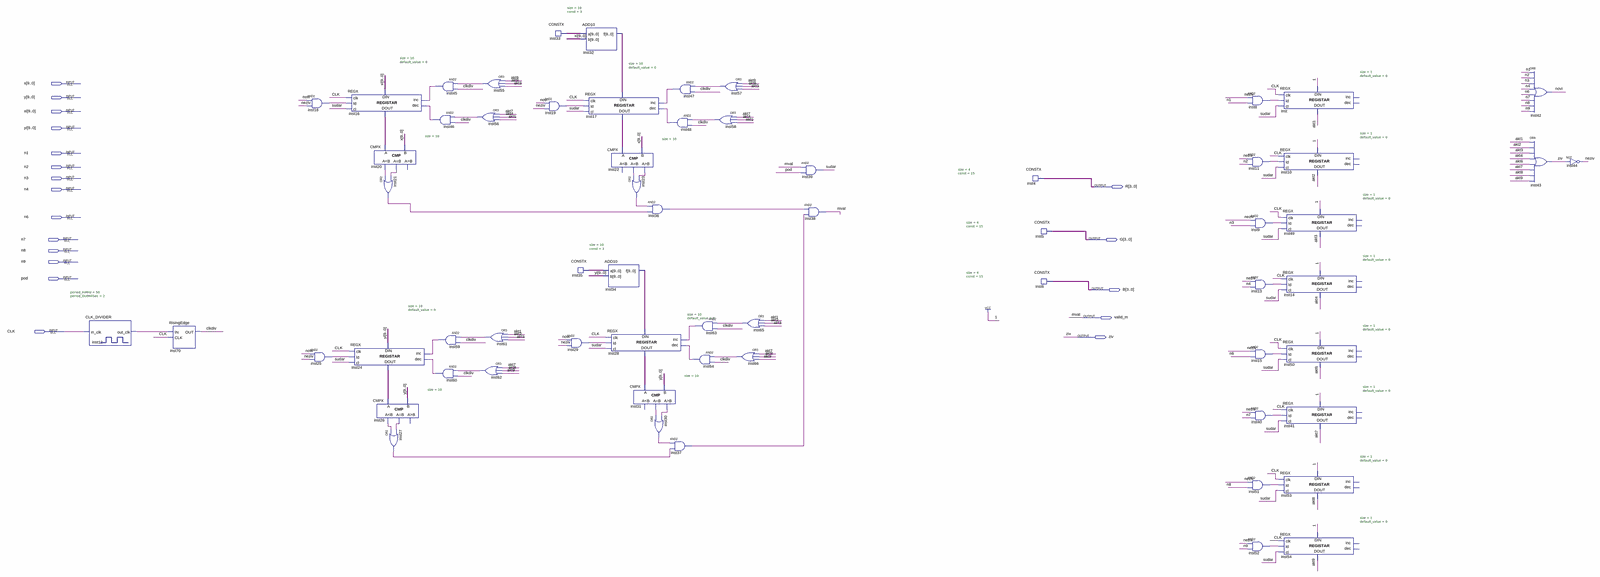
[diagram p0: schematic sheet, whole]
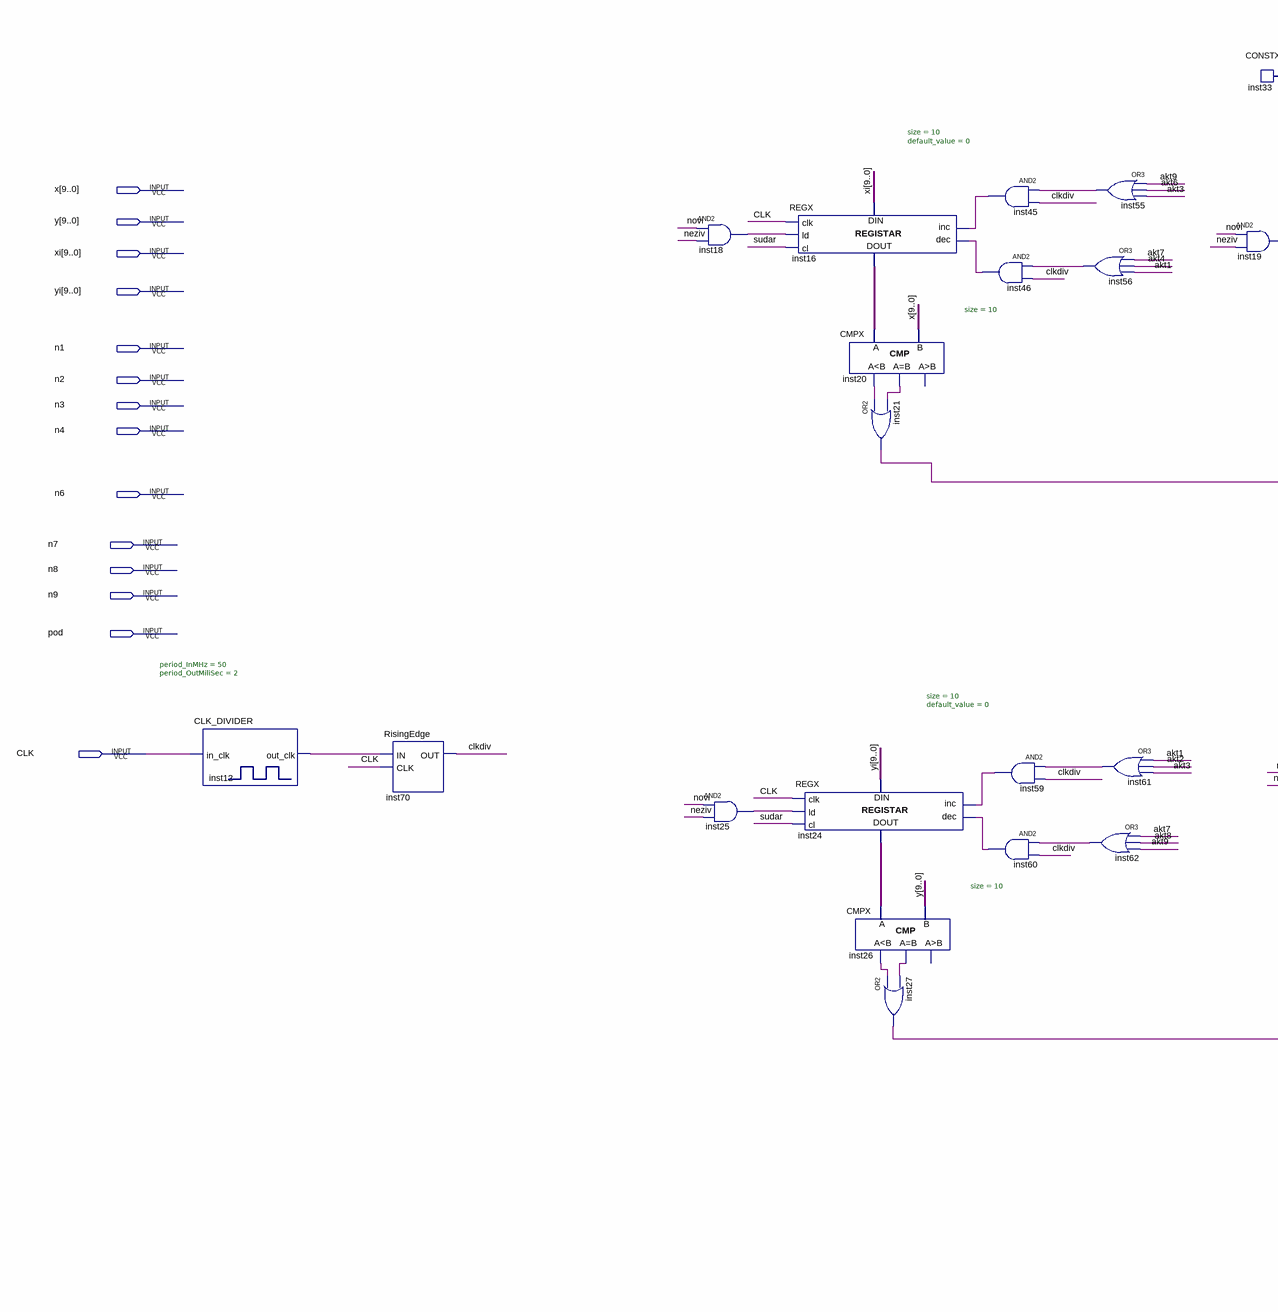
[diagram p1: schematic sheet, left part]
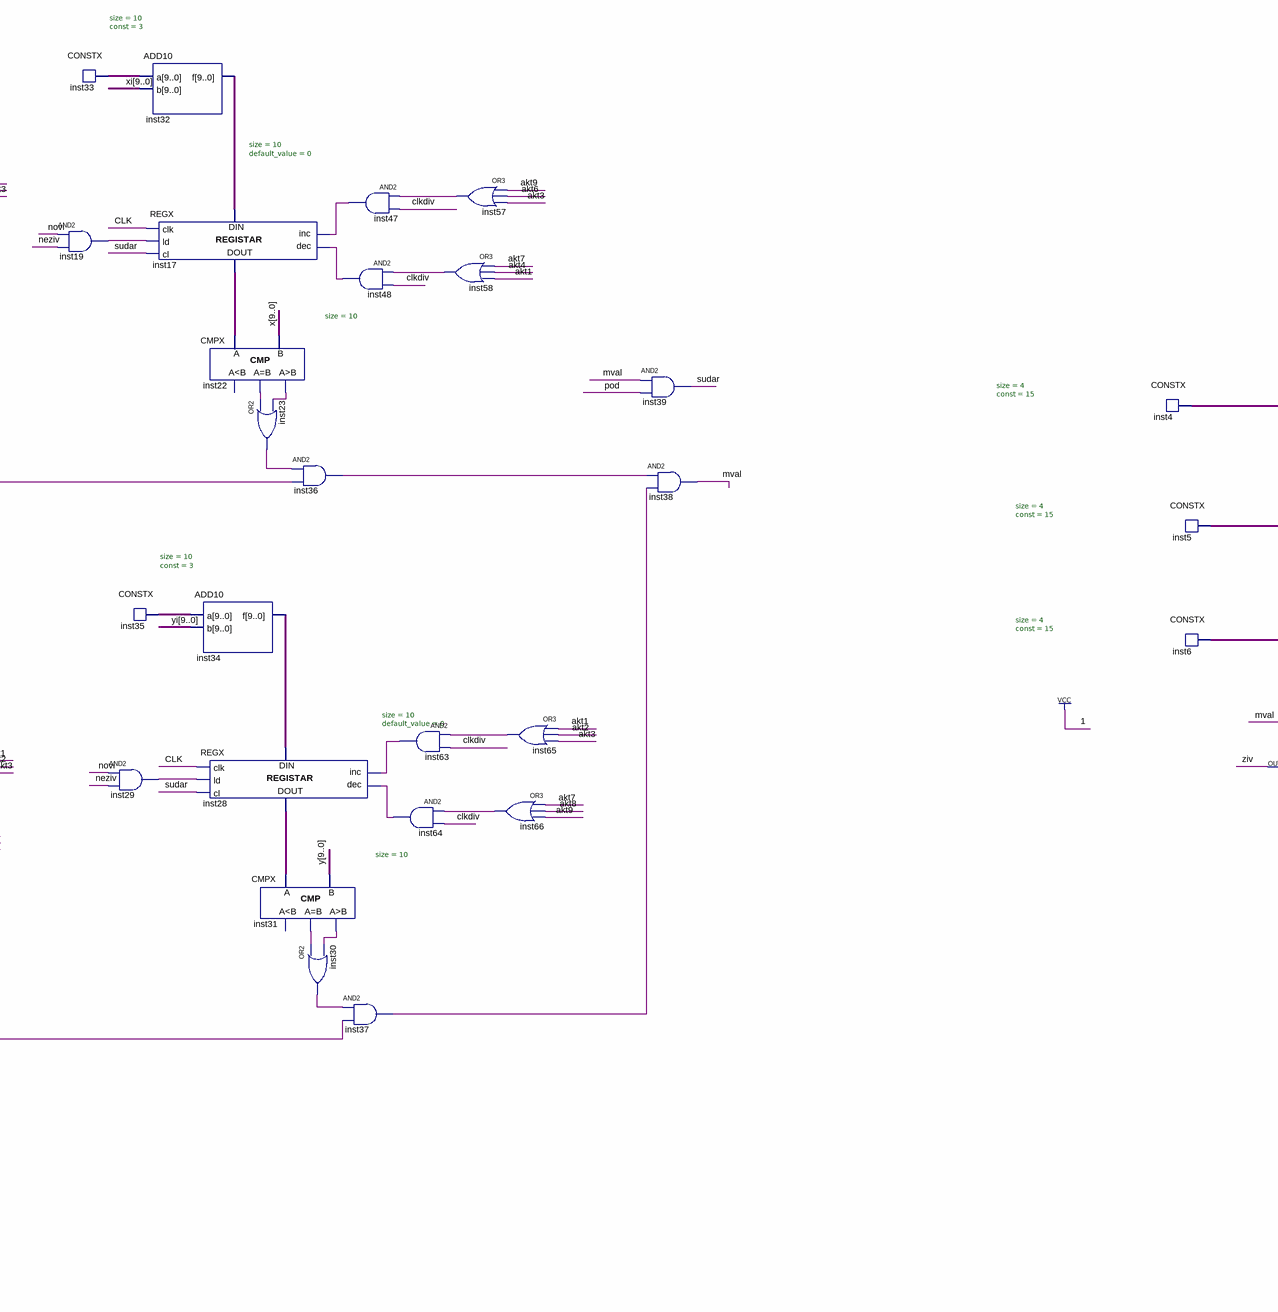
[diagram p2: schematic sheet, centre part]
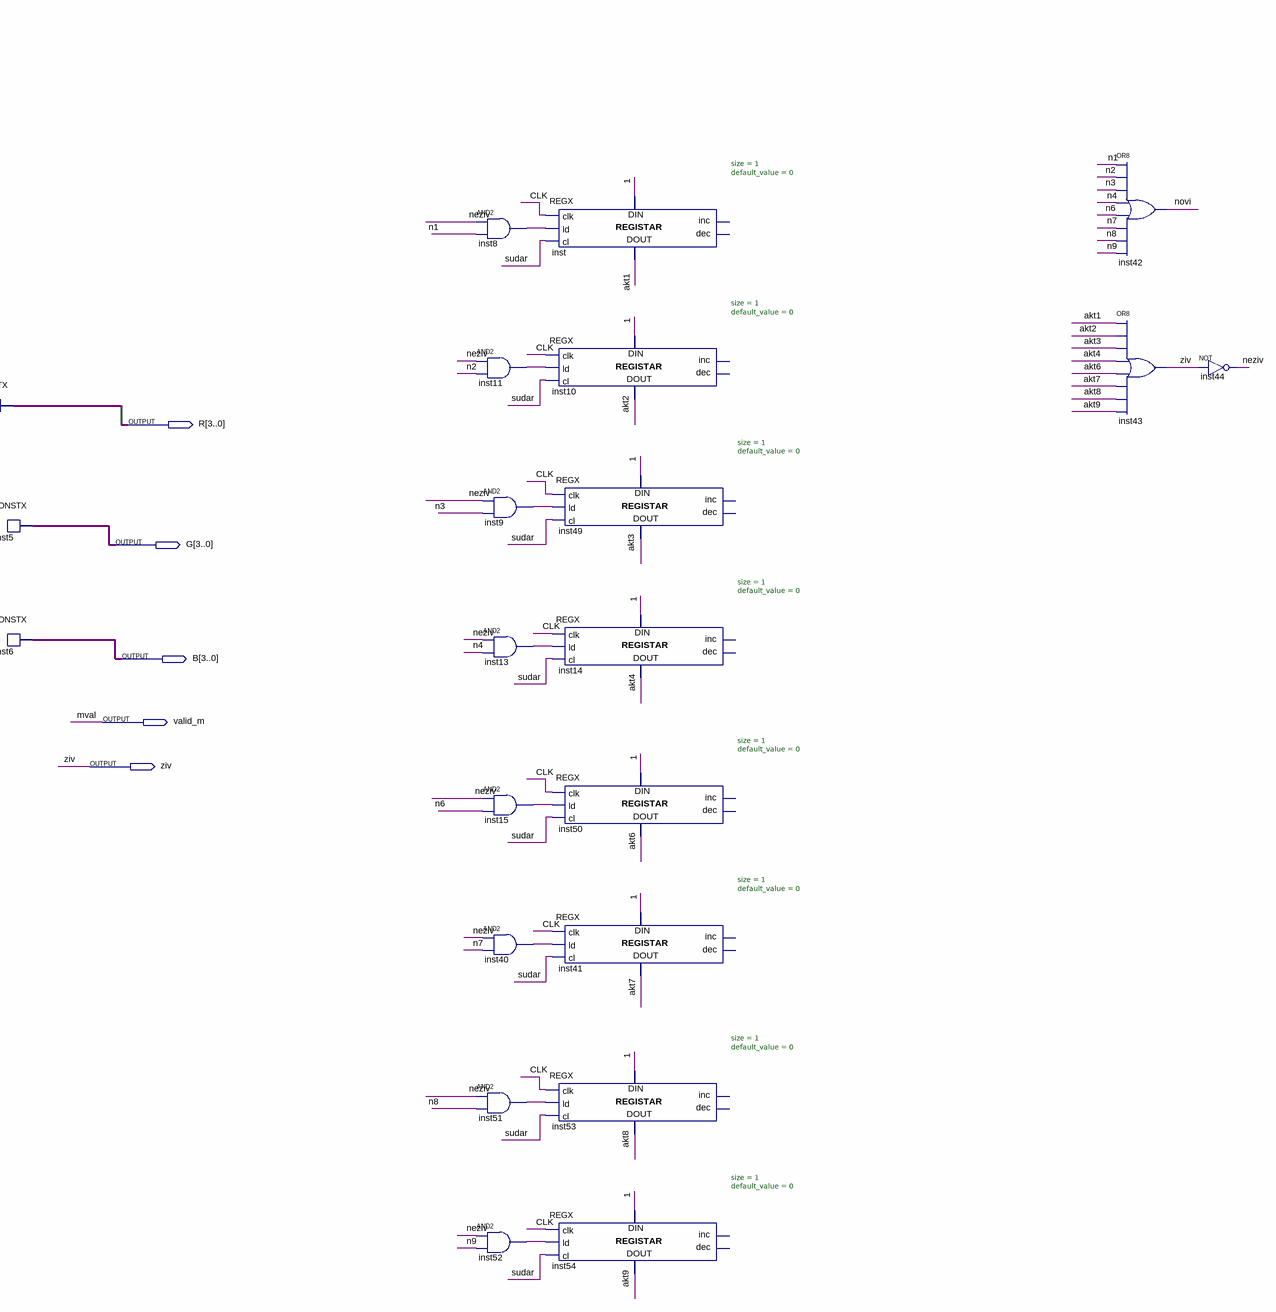
[diagram p3: schematic sheet, right part]
// Quartus schematic Metak.bdf as structural Verilog: 64 symbols, 19 pins
module Metak (
  input  [9:0] x,
  input  [9:0] y,
  input  [9:0] xi,
  input  [9:0] yi,
  input  n1,
  input  n2,
  input  n3,
  input  n4,
  input  n6,
  input  n7,
  input  n8,
  input  n9,
  input  pod,
  input  CLK,
  output [3:0] R,
  output [3:0] G,
  output [3:0] B,
  output valid_m,
  output ziv
);

  wire akt1, akt2, akt3, akt4, akt6, akt7, akt8, akt9, clkdiv, inst8_out, inst9_out, inst11_out,
       inst12_out_clk, inst13_out, inst15_out, inst18_out, inst19_out, inst20_eq, inst20_ls, inst21_out,
       inst22_eq, inst22_gr, inst23_out, inst25_out, inst26_eq, inst26_ls, inst27_out, inst29_out,
       inst30_out, inst31_eq, inst31_gr, inst36_out, inst37_out, inst40_out, inst45_out, inst46_out,
       inst47_out, inst48_out, inst51_out, inst52_out, inst55_out, inst56_out, inst57_out, inst58_out,
       inst59_out, inst60_out, inst61_out, inst62_out, inst63_out, inst64_out, inst65_out, inst66_out, neziv,
       novi, sudar;
  wire [9:0] inst16_data_out, inst17_data_out, inst24_data_out, inst28_data_out, inst32_f, inst33_data,
       inst34_f, inst35_data;

  CLK_DIVIDER #(.period_InMHz(50), .period_OutMiliSec(2)) inst12 (.in_clk(CLK), .out_clk(inst12_out_clk));
  RisingEdge inst70 (.IN(inst12_out_clk), .CLK(CLK), .OUT(clkdiv));
  and inst18 (inst18_out, novi, neziv);
  and inst25 (inst25_out, novi, neziv);
  REGX #(.size(10), .default_value(0)) inst16 (
    .clk(CLK), .ld(inst18_out), .cl(sudar), .inc(inst45_out), .dec(inst46_out), .data_in(xi),
    .data_out(inst16_data_out));
  REGX #(.size(10), .default_value(0)) inst24 (
    .clk(CLK), .ld(inst25_out), .cl(sudar), .inc(inst59_out), .dec(inst60_out), .data_in(yi),
    .data_out(inst24_data_out));
  CMPX #(.size(10)) inst20 (.A(inst16_data_out), .B(x), .ls(inst20_ls), .eq(inst20_eq));  // open: gr
  CMPX #(.size(10)) inst26 (.A(inst24_data_out), .B(y), .ls(inst26_ls), .eq(inst26_eq));  // open: gr
  or inst21 (inst21_out, inst20_ls, inst20_eq);
  or inst27 (inst27_out, inst26_ls, inst26_eq);
  and inst45 (inst45_out, inst55_out, clkdiv);
  and inst46 (inst46_out, inst56_out, clkdiv);
  and inst59 (inst59_out, inst61_out, clkdiv);
  and inst60 (inst60_out, inst62_out, clkdiv);
  or inst55 (inst55_out, akt9, akt6, akt3);
  or inst56 (inst56_out, akt7, akt4, akt1);
  or inst61 (inst61_out, akt1, akt2, akt3);
  or inst62 (inst62_out, akt7, akt8, akt9);
  CONSTX #(.size(10), .\const (3)) inst33 (.data(inst33_data));
  and inst19 (inst19_out, novi, neziv);
  CONSTX #(.size(10), .\const (3)) inst35 (.data(inst35_data));
  and inst29 (inst29_out, novi, neziv);
  ADD10 inst32 (.a(inst33_data), .b(xi), .f(inst32_f));
  REGX #(.size(10), .default_value(0)) inst17 (
    .clk(CLK), .ld(inst19_out), .cl(sudar), .inc(inst47_out), .dec(inst48_out), .data_in(inst32_f),
    .data_out(inst17_data_out));
  CMPX #(.size(10)) inst22 (.A(inst17_data_out), .B(x), .eq(inst22_eq), .gr(inst22_gr));  // open: ls
  ADD10 inst34 (.a(inst35_data), .b(yi), .f(inst34_f));
  REGX #(.size(10), .default_value(0)) inst28 (
    .clk(CLK), .ld(inst29_out), .cl(sudar), .inc(inst63_out), .dec(inst64_out), .data_in(inst34_f),
    .data_out(inst28_data_out));
  or inst23 (inst23_out, inst22_eq, inst22_gr);
  CMPX #(.size(10)) inst31 (.A(inst28_data_out), .B(y), .eq(inst31_eq), .gr(inst31_gr));  // open: ls
  and inst36 (inst36_out, inst23_out, inst21_out);
  or inst30 (inst30_out, inst31_eq, inst31_gr);
  and inst47 (inst47_out, inst57_out, clkdiv);
  and inst48 (inst48_out, inst58_out, clkdiv);
  and inst37 (inst37_out, inst30_out, inst27_out);
  and inst63 (inst63_out, inst65_out, clkdiv);
  and inst64 (inst64_out, inst66_out, clkdiv);
  or inst57 (inst57_out, akt9, akt6, akt3);
  or inst58 (inst58_out, akt7, akt4, akt1);
  or inst65 (inst65_out, akt1, akt2, akt3);
  or inst66 (inst66_out, akt7, akt8, akt9);
  and inst39 (sudar, valid_m, pod);
  and inst38 (valid_m, inst36_out, inst37_out);
  CONSTX #(.size(4), .\const (15)) inst4 (.data(R));
  CONSTX #(.size(4), .\const (15)) inst5 (.data(G));
  CONSTX #(.size(4), .\const (15)) inst6 (.data(B));
  and inst8 (inst8_out, neziv, n1);
  and inst11 (inst11_out, neziv, n2);
  and inst9 (inst9_out, neziv, n3);
  and inst13 (inst13_out, neziv, n4);
  and inst15 (inst15_out, neziv, n6);
  and inst40 (inst40_out, neziv, n7);
  and inst51 (inst51_out, neziv, n8);
  and inst52 (inst52_out, neziv, n9);
  REGX #(.size(1), .default_value(0)) inst (
    .clk(CLK), .ld(inst8_out), .cl(sudar), .data_in(1'b1), .data_out(akt1));  // open: inc, dec
  REGX #(.size(1), .default_value(0)) inst10 (
    .clk(CLK), .ld(inst11_out), .cl(sudar), .data_in(1'b1), .data_out(akt2));  // open: inc, dec
  REGX #(.size(1), .default_value(0)) inst49 (
    .clk(CLK), .ld(inst9_out), .cl(sudar), .data_in(1'b1), .data_out(akt3));  // open: inc, dec
  REGX #(.size(1), .default_value(0)) inst14 (
    .clk(CLK), .ld(inst13_out), .cl(sudar), .data_in(1'b1), .data_out(akt4));  // open: inc, dec
  REGX #(.size(1), .default_value(0)) inst50 (
    .clk(CLK), .ld(inst15_out), .cl(sudar), .data_in(1'b1), .data_out(akt6));  // open: inc, dec
  REGX #(.size(1), .default_value(0)) inst41 (
    .clk(CLK), .ld(inst40_out), .cl(sudar), .data_in(1'b1), .data_out(akt7));  // open: inc, dec
  REGX #(.size(1), .default_value(0)) inst53 (
    .clk(CLK), .ld(inst51_out), .cl(sudar), .data_in(1'b1), .data_out(akt8));  // open: inc, dec
  REGX #(.size(1), .default_value(0)) inst54 (
    .clk(CLK), .ld(inst52_out), .cl(sudar), .data_in(1'b1), .data_out(akt9));  // open: inc, dec
  or inst42 (novi, n1, n2, n3, n4, n6, n7, n8, n9);
  or inst43 (ziv, akt1, akt2, akt3, akt4, akt6, akt7, akt8, akt9);
  not inst44 (neziv, ziv);

  // Other names for the same wires on the sheet: mval = valid_m
endmodule
